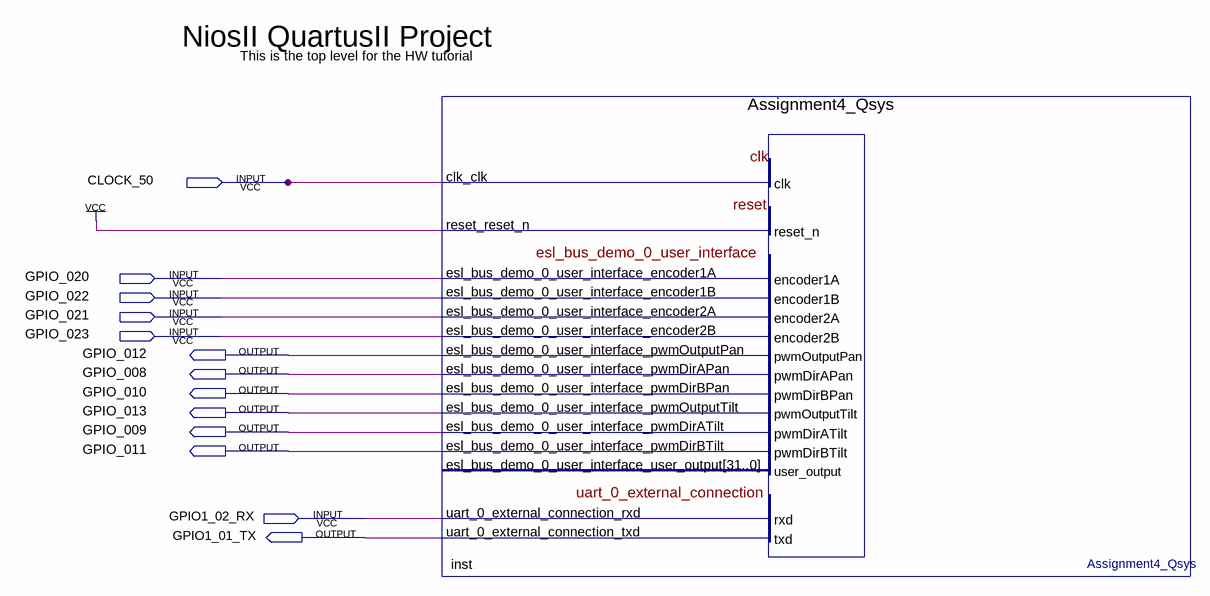
[diagram p0: schematic sheet]
// Quartus schematic nios2_quartus2_project.bdf as structural Verilog: 1 symbols, 13 pins
module nios2_quartus2_project (
  input  CLOCK_50,
  input  GPIO_020,
  input  GPIO_022,
  input  GPIO_021,
  input  GPIO_023,
  input  GPIO1_02_RX,
  output GPIO_012,
  output GPIO_008,
  output GPIO_010,
  output GPIO_013,
  output GPIO_009,
  output GPIO_011,
  output GPIO1_01_TX
);

  Assignment4_Qsys inst (
    .clk_clk(CLOCK_50), .reset_reset_n(1'b1), .esl_bus_demo_0_user_interface_encoder1A(GPIO_020),
    .esl_bus_demo_0_user_interface_encoder1B(GPIO_022), .esl_bus_demo_0_user_interface_encoder2A(GPIO_021),
    .esl_bus_demo_0_user_interface_encoder2B(GPIO_023), .uart_0_external_connection_rxd(GPIO1_02_RX),
    .esl_bus_demo_0_user_interface_pwmOutputPan(GPIO_012),
    .esl_bus_demo_0_user_interface_pwmDirAPan(GPIO_008), .esl_bus_demo_0_user_interface_pwmDirBPan(GPIO_010),
    .esl_bus_demo_0_user_interface_pwmOutputTilt(GPIO_013),
    .esl_bus_demo_0_user_interface_pwmDirATilt(GPIO_009),
    .esl_bus_demo_0_user_interface_pwmDirBTilt(GPIO_011), .uart_0_external_connection_txd(GPIO1_01_TX));  // open: esl_bus_demo_0_user_interface_user_output

  // Notes on the sheet:
  //   NiosII QuartusII Project
  //   This is the top level for the HW tutorial
endmodule
